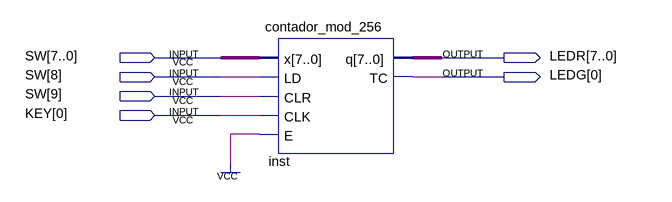
[diagram p0: schematic sheet]
// Quartus schematic contador_mod_256_TESTE.bdf as structural Verilog: 1 symbols, 6 pins
module contador_mod_256_TESTE (
  input  [9:0] SW,
  input  [0:0] KEY,
  output [7:0] LEDR,
  output [0:0] LEDG
);

  contador_mod_256 inst (.x(SW[7:0]), .LD(SW[8]), .CLR(SW[9]), .CLK(KEY[0]), .E(1'b1), .q(LEDR), .TC(LEDG[0]));
endmodule
